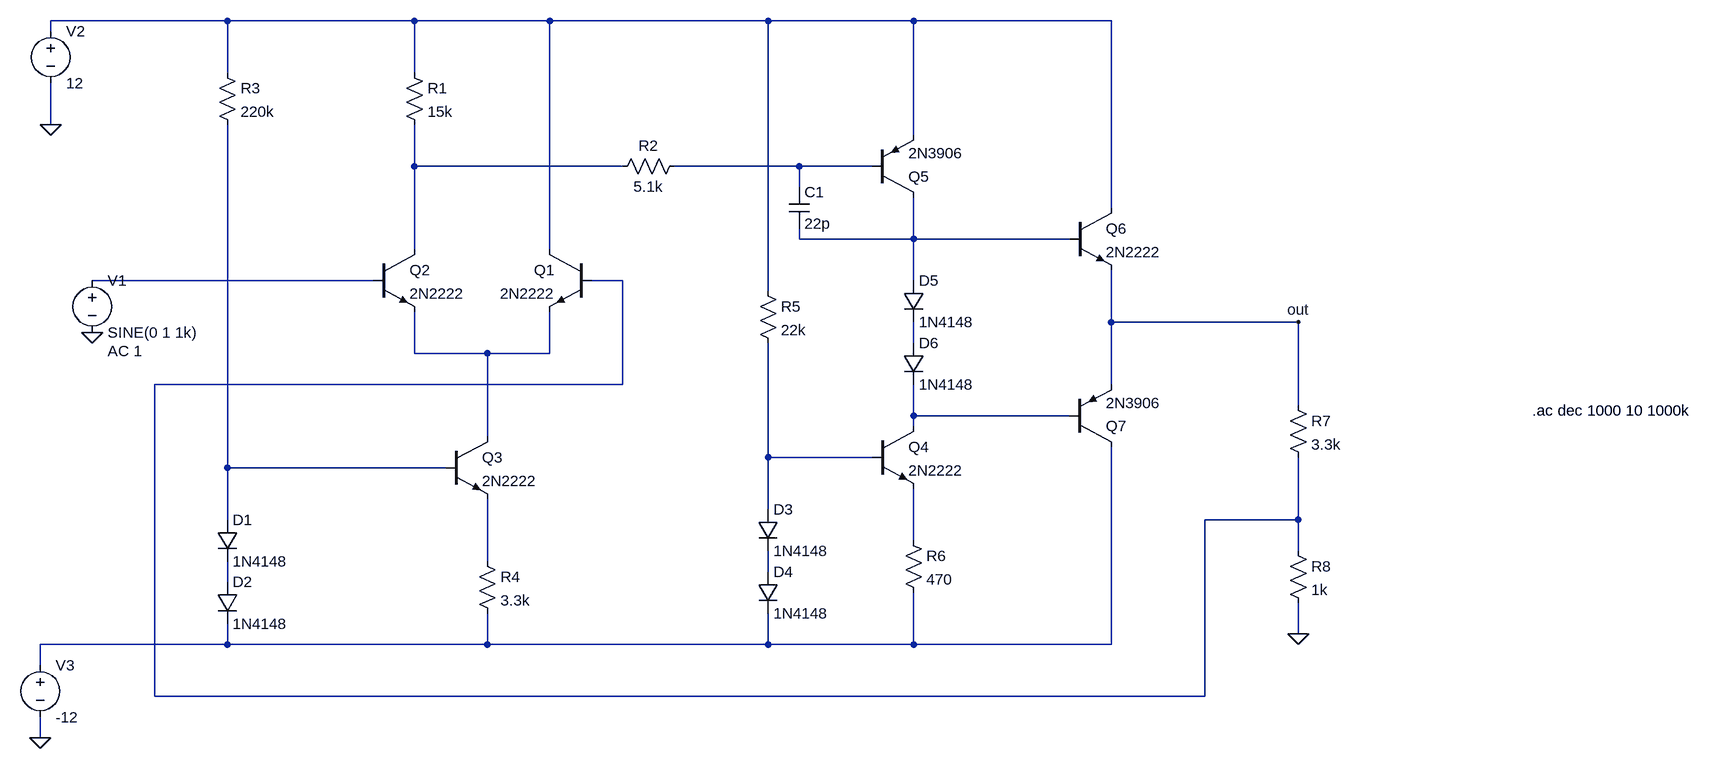
[diagram p0: schematic Op-amp.asc]
Op-amp.asc, the LTspice schematic file:
Version 4
SHEET 1 2048 1112
WIRE -224 -32 -496 -32
WIRE 64 -32 -224 -32
WIRE 272 -32 64 -32
WIRE 608 -32 272 -32
WIRE 832 -32 608 -32
WIRE 1136 -32 832 -32
WIRE -496 -16 -496 -32
WIRE -224 48 -224 -32
WIRE 64 48 64 -32
WIRE -496 128 -496 64
WIRE 832 144 832 -32
WIRE 64 192 64 128
WIRE 384 192 64 192
WIRE 656 192 464 192
WIRE 768 192 656 192
WIRE 656 224 656 192
WIRE 1136 256 1136 -32
WIRE 656 304 656 288
WIRE 832 304 832 240
WIRE 832 304 656 304
WIRE 1072 304 832 304
WIRE 64 320 64 192
WIRE 272 320 272 -32
WIRE 0 368 -432 368
WIRE 384 368 336 368
WIRE 832 368 832 304
WIRE 608 384 608 -32
WIRE 1136 432 1136 352
WIRE 1424 432 1136 432
WIRE 832 464 832 432
WIRE 64 480 64 416
WIRE 176 480 64 480
WIRE 272 480 272 416
WIRE 272 480 176 480
WIRE 384 528 384 368
WIRE 384 528 -336 528
WIRE 1136 528 1136 432
WIRE 1424 560 1424 432
WIRE 832 576 832 528
WIRE 1072 576 832 576
WIRE 832 592 832 576
WIRE 176 608 176 480
WIRE 608 640 608 464
WIRE 768 640 608 640
WIRE -224 656 -224 128
WIRE 112 656 -224 656
WIRE 608 720 608 640
WIRE -224 736 -224 656
WIRE 1424 736 1424 640
WIRE 1424 736 1280 736
WIRE 832 768 832 688
WIRE 1424 784 1424 736
WIRE 176 800 176 704
WIRE 608 816 608 784
WIRE -224 832 -224 800
WIRE 1424 912 1424 864
WIRE -224 928 -224 896
WIRE -224 928 -512 928
WIRE 176 928 176 880
WIRE 176 928 -224 928
WIRE 608 928 608 880
WIRE 608 928 176 928
WIRE 832 928 832 848
WIRE 832 928 608 928
WIRE 1136 928 1136 624
WIRE 1136 928 832 928
WIRE -512 960 -512 928
WIRE -336 1008 -336 528
WIRE 1280 1008 1280 736
WIRE 1280 1008 -336 1008
WIRE -512 1072 -512 1040
FLAG -432 448 0
FLAG -496 128 0
FLAG -512 1072 0
FLAG 1424 912 0
FLAG 1424 432 out
SYMBOL res 48 32 R0
SYMATTR InstName R1
SYMATTR Value 15k
SYMBOL npn 336 320 M0
SYMATTR InstName Q1
SYMATTR Value 2N2222
SYMBOL npn 0 320 R0
SYMATTR InstName Q2
SYMATTR Value 2N2222
SYMBOL npn 112 608 R0
SYMATTR InstName Q3
SYMATTR Value 2N2222
SYMBOL res -240 32 R0
SYMATTR InstName R3
SYMATTR Value 220k
SYMBOL voltage -432 352 R0
WINDOW 123 24 124 Left 2
WINDOW 39 0 0 Left 0
SYMATTR Value2 AC 1
SYMATTR InstName V1
SYMATTR Value SINE(0 1 1k)
SYMBOL res 160 784 R0
SYMATTR InstName R4
SYMATTR Value 3.3k
SYMBOL diode -240 736 R0
SYMATTR InstName D1
SYMATTR Value 1N4148
SYMBOL diode -240 832 R0
SYMATTR InstName D2
SYMATTR Value 1N4148
SYMBOL res 480 176 R90
WINDOW 0 0 56 VBottom 2
WINDOW 3 32 56 VTop 2
SYMATTR InstName R2
SYMATTR Value 5.1k
SYMBOL res 592 368 R0
SYMATTR InstName R5
SYMATTR Value 22k
SYMBOL diode 592 720 R0
SYMATTR InstName D3
SYMATTR Value 1N4148
SYMBOL diode 592 816 R0
SYMATTR InstName D4
SYMATTR Value 1N4148
SYMBOL res 816 752 R0
SYMATTR InstName R6
SYMATTR Value 470
SYMBOL npn 768 592 R0
SYMATTR InstName Q4
SYMATTR Value 2N2222
SYMBOL diode 816 368 R0
SYMATTR InstName D5
SYMATTR Value 1N4148
SYMBOL diode 816 464 R0
SYMATTR InstName D6
SYMATTR Value 1N4148
SYMBOL pnp 768 240 M180
SYMATTR InstName Q5
SYMATTR Value 2N3906
SYMBOL cap 640 224 R0
SYMATTR InstName C1
SYMATTR Value 22p
SYMBOL npn 1072 256 R0
SYMATTR InstName Q6
SYMATTR Value 2N2222
SYMBOL pnp 1072 624 M180
SYMATTR InstName Q7
SYMATTR Value 2N3906
SYMBOL res 1408 544 R0
SYMATTR InstName R7
SYMATTR Value 3.3k
SYMBOL voltage -496 -32 R0
WINDOW 123 0 0 Left 0
WINDOW 39 0 0 Left 0
SYMATTR InstName V2
SYMATTR Value 12
SYMBOL voltage -512 944 R0
WINDOW 123 0 0 Left 0
WINDOW 39 0 0 Left 0
SYMATTR InstName V3
SYMATTR Value -12
SYMBOL res 1408 768 R0
SYMATTR InstName R8
SYMATTR Value 1k
TEXT 1784 568 Left 2 !.ac dec 1000 10 1000k

The netlist it stands for:
* Op-amp.asc
R1 N001 N002 15k
Q1 N001 N006 N008 0 2N2222
Q2 N002 N005 N008 0 2N2222
Q3 N008 N011 N013 0 2N2222
R3 N001 N011 220k
V1 N005 0 SINE(0 1 1k) AC 1
R4 N013 N016 3.3k
D1 N011 N015 1N4148
D2 N015 N016 1N4148
R2 N003 N002 5.1k
R5 N001 N010 22k
D3 N010 N014 1N4148
D4 N014 N016 1N4148
R6 N012 N016 470
Q4 N009 N010 N012 0 2N2222
D5 N004 N007 1N4148
D6 N007 N009 1N4148
Q5 N004 N003 N001 0 2N3906
C1 N003 N004 22p
Q6 N001 N004 out 0 2N2222
Q7 N016 N009 out 0 2N3906
R7 out N006 3.3k
V2 N001 0 12
V3 N016 0 -12
R8 N006 0 1k
.model D D
.lib standard.dio
.model NPN NPN
.model PNP PNP
.lib standard.bjt
.ac dec 1000 10 1000k
.backanno
.end